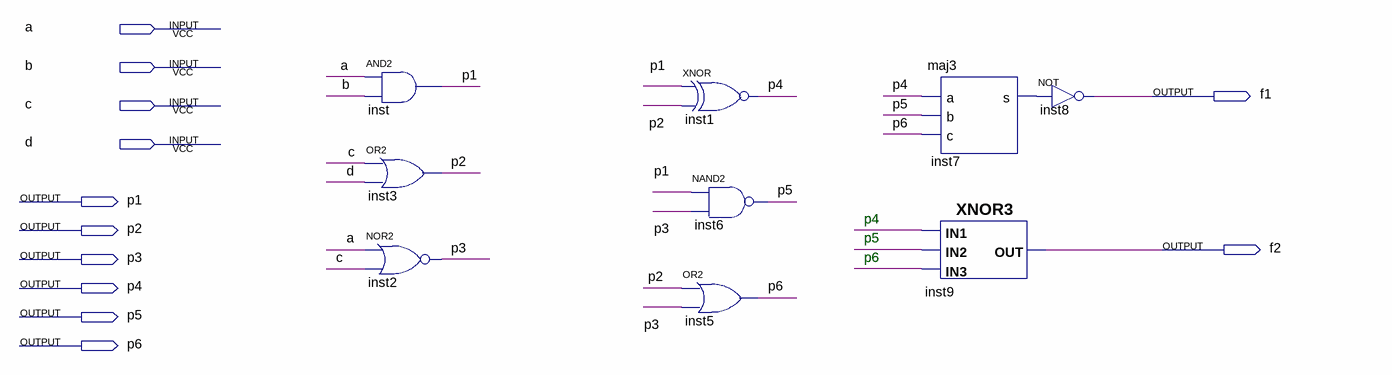
[diagram p0: schematic sheet]
// Quartus schematic mbr_circ1.bdf as structural Verilog: 9 symbols, 12 pins
module mbr_circ1 (
  input  a,
  input  b,
  input  c,
  input  d,
  output f1,
  output p1,
  output p2,
  output f2,
  output p3,
  output p4,
  output p5,
  output p6
);

  wire inst7_s;

  and inst (p1, a, b);
  or inst3 (p2, c, d);
  nor inst2 (p3, a, c);
  xnor inst1 (p4, p1, p2);
  nand inst6 (p5, p1, p3);
  or inst5 (p6, p2, p3);
  maj3 inst7 (.a(p4), .b(p5), .c(p6), .s(inst7_s));
  XNOR3 inst9 (.IN3(p6), .IN2(p5), .IN1(p4), .OUT(f2));
  not inst8 (f1, inst7_s);

  // Notes on the sheet:
  //   p4
  //   p5
  //   p6
endmodule
